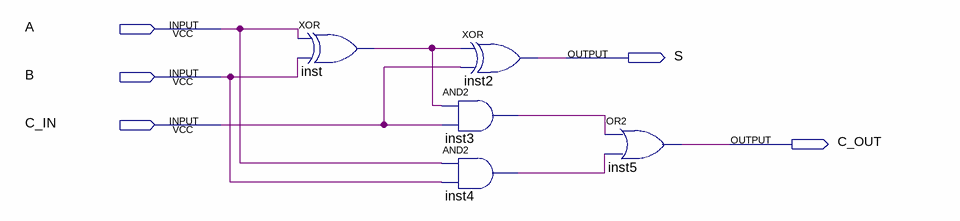
[diagram p0: schematic sheet]
// Quartus schematic full_adder.bdf as structural Verilog: 5 symbols, 5 pins
module full_adder (
  input  A,
  input  B,
  input  C_IN,
  output S,
  output C_OUT
);

  wire inst3_out, inst4_out, inst_out;

  xor inst (inst_out, A, B);
  and inst3 (inst3_out, inst_out, C_IN);
  and inst4 (inst4_out, A, B);
  xor inst2 (S, inst_out, C_IN);
  or inst5 (C_OUT, inst3_out, inst4_out);
endmodule
